# Altium schematic sheet I2S_ADC_OPTION.SchDoc
size A4
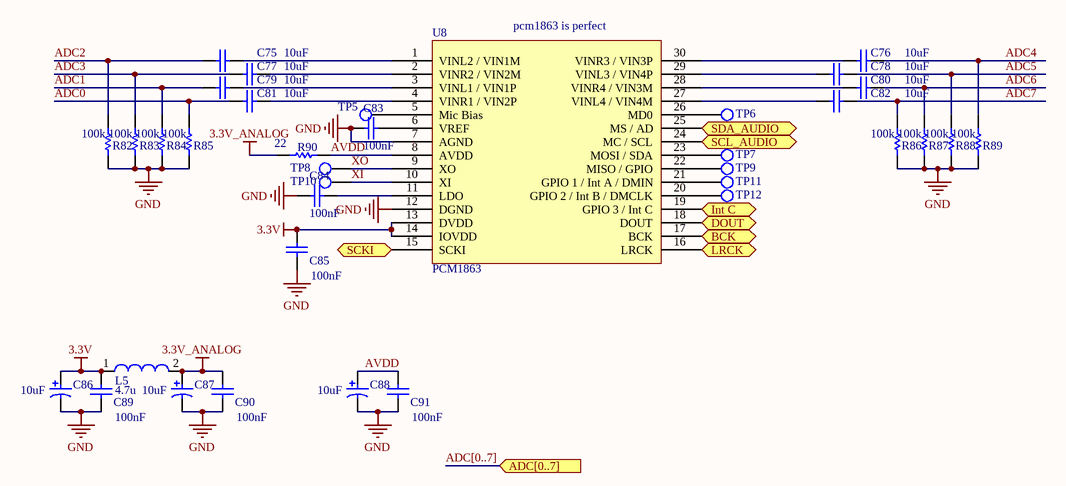
[diagram p0: I2S_ADC_OPTION.SchDoc]

## Parts
C75  value 10uF  [CAPC0402(1005)60_L]  (hidden comment: CAP0402)
C76  value 10uF  [CAPC0402(1005)60_L]  (hidden comment: CAP0402)
C77  value 10uF  [CAPC0402(1005)60_L]  (hidden comment: CAP0402)
C78  value 10uF  [CAPC0402(1005)60_L]  (hidden comment: CAP0402)
C79  value 10uF  [CAPC0402(1005)60_L]  (hidden comment: CAP0402)
C80  value 10uF  [CAPC0402(1005)60_L]  (hidden comment: CAP0402)
C81  value 10uF  [CAPC0402(1005)60_L]  (hidden comment: CAP0402)
C82  value 10uF  [CAPC0402(1005)60_L]  (hidden comment: CAP0402)
C83  value 100nF  [CAPC0402(1005)60_L]  (hidden comment: CAP0402)
C84  value 100nF  [CAPC0402(1005)60_L]  (hidden comment: CAP0402)
C85  value 100nF  [CAPC0402(1005)60_L]  (hidden comment: CAP0402)
C86  Capacitance: 10uF  [KEMT-A-3216-18-2_M]  (hidden comment: T491A106K016AT)
C87  Capacitance: 10uF  [KEMT-A-3216-18-2_M]  (hidden comment: T491A106K016AT)
C88  Capacitance: 10uF  [KEMT-A-3216-18-2_M]  (hidden comment: T491A106K016AT)
C89  value 100nF  [CAPC0402(1005)60_L]  (hidden comment: CAP0402)
C90  value 100nF  [CAPC0402(1005)60_L]  (hidden comment: CAP0402)
C91  value 100nF  [CAPC0402(1005)60_L]  (hidden comment: CAP0402)
L5  L: 4.7u  [TYS5020220M-10]  (hidden comment: TYS50204R7N-10)
R82  value 100k  [RESC0402(1005)_L]  (hidden comment: RES0402)
R83  value 100k  [RESC0402(1005)_L]  (hidden comment: RES0402)
R84  value 100k  [RESC0402(1005)_L]  (hidden comment: RES0402)
R85  value 100k  [RESC0402(1005)_L]  (hidden comment: RES0402)
R86  value 100k  [RESC0402(1005)_L]  (hidden comment: RES0402)
R87  value 100k  [RESC0402(1005)_L]  (hidden comment: RES0402)
R88  value 100k  [RESC0402(1005)_L]  (hidden comment: RES0402)
R89  value 100k  [RESC0402(1005)_L]  (hidden comment: RES0402)
R90  value 22  [RESC0402(1005)_L]  (hidden comment: RES0402)
TP5  Test Point  [Test_Point]  (value not drawn)
TP6  Test Point  [Test_Point]  (value not drawn)
TP7  Test Point  [Test_Point]  (value not drawn)
TP8  Test Point  [Test_Point]  (value not drawn)
TP9  Test Point  [Test_Point]  (value not drawn)
TP10  Test Point  [Test_Point]  (value not drawn)
TP11  Test Point  [Test_Point]  (value not drawn)
TP12  Test Point  [Test_Point]  (value not drawn)
U8  PCM1863  [TSSOP30]

## Ports
ADC[0..7] (in), BCK (bidir), DOUT (out), Int C (out), LRCK (bidir), SCKI (in), SCL_AUDIO (bidir), SDA_AUDIO (in)

## Nets
3.3V: C85.1 C86.1 C89.1 L5.1 U8.13(DVDD) U8.14(IOVDD)
3.3V_ANALOG: C87.1 C90.1 L5.2 R90.2
GND: C83.1 C84.1 C85.2 C86.2 C87.2 C88.2 C89.2 C90.2 C91.2 R82.1 R83.1 R84.1 R85.1 R86.1 R87.1 R88.1 R89.1 U8.7(AGND) U8.12(DGND)
ADC0: C81.1 R85.2
ADC1: C79.1 R84.2
ADC2: C75.1 R82.2
ADC3: C77.1 R83.2
ADC4: C78.2 R89.2
ADC5: C76.2 R88.2
ADC6: C80.2 R87.2
ADC7: C82.2 R86.2
AVDD: C88.1 C91.1 R90.1 U8.8(AVDD)
BCK: U8.17(BCK) ; port BCK
DOUT: U8.18(DOUT) ; port DOUT
Int C: U8.19(GPIO_3_/_Int_C) ; port Int C
LRCK: U8.16(LRCK) ; port LRCK
SCKI: U8.15(SCKI) ; port SCKI
SCL_AUDIO: U8.24(MC_/_SCL) ; port SCL_AUDIO
SDA_AUDIO: U8.25(MS_/_AD) ; port SDA_AUDIO
XI: TP10.1(TP) U8.10(XI)
XO: TP8.1(TP) U8.9(XO)
NetC75_2: C75.2 U8.1(VINL2_/_VIN1M)
NetC76_1: C76.1 U8.29(VINL3_/_VIN4P)
NetC77_2: C77.2 U8.2(VINR2_/_VIN2M)
NetC78_1: C78.1 U8.30(VINR3_/_VIN3P)
NetC79_2: C79.2 U8.3(VINL1_/_VIN1P)
NetC80_1: C80.1 U8.28(VINR4_/_VIN3M)
NetC81_2: C81.2 U8.4(VINR1_/_VIN2P)
NetC82_1: C82.1 U8.27(VINL4_/_VIN4M)
NetC83_2: C83.2 U8.6(VREF)
NetC84_2: C84.2 U8.11(LDO)
NetTP5_1: TP5.1(TP) U8.5(Mic_Bias)
NetTP6_1: TP6.1(TP) U8.26(MD0)
NetTP7_1: TP7.1(TP) U8.23(MOSI_/_SDA)
NetTP9_1: TP9.1(TP) U8.22(MISO_/_GPIO)
NetTP11_1: TP11.1(TP) U8.21(GPIO_1_/_Int_A_/_DMIN)
NetTP12_1: TP12.1(TP) U8.20(GPIO_2_/_Int_B_/_DMCLK)

## Buses and harness runs
bus ADC[0..7] = port ADC[0..7]

## Notes on the sheet
- (near U8) pcm1863 is perfect

## Library data of the parts
C75-C85 C89-C91 = CMP-1590-00004-1: 0402 (1005 Metric) Chip Capacitor; Case-EIA: 0402; Case-Metric: 1005; PackageReference: CAPC0402(1005)60
C86-C88 = CMP-2000-05173-1: Capacitor, Tantalum, 10 uF, +/- 10%, 16 V, -55 to 125 degC, 2-Pin SMD (1206), RoHS, Tape and Reel; Manufacturer: Kemet; Insulation: NotRequired; Voltage: 16VDC; Product Height (mm): 1.6mm; Polarity: Polar; Lead Spacing (nom): NotRequiredmm; Product Length (mm): 3.2mm; Case Style: Molded; DCL: 1.6uA; ESR: 7ohm; DF: 8%; Mounting Style: SurfaceMount; Manufacturer URL: http://www.kemet.com/; Datasheet Version: Apr-14; Package Description: 2-Pin Surface Mount Device, Body 3.2 x 1.6 mm; Operating Temp Range: -55Cto125C; Package Reference: 1206; Wire Form: NotRequired; Datasheet URL: http://www.farnell.com/datasheets/1824869.pdf; Tolerance (+ or -): 10%; Failure Rate: NotRequired; Length W/Weld: NotRequiredmm; Package / Case: 3216-18; Seated Plane Height: NotRequiredmm; Product Diameter (mm): NotRequiredmm; Construction: SMTChip; Seal: NotRequired; Case Code: A; Product Depth (mm): 1.6mm; Packaging: TapeandReel
L5 = TYS50204R7N-10: LAIRD TECHNOLOGIES  TYS50204R7N-10  Surface Mount Power Inductor, TYS Series, 4.7 µH, ± 30%, Shielded, 0.057 ohm, 2.2 A; Manufacturer: Wurth Elektronik; IR: 4.9 A; Isat: 5.5 A; Rdc typ.: 57 mOhm; Rdc max.: 22 mOhm; Frequence: 30 MHz; Unit Cost: .849; ComponentLink1Description: Manufacturer; ComponentLink1URL: http://ie.farnell.com/laird-technologies/tys50204r7n-10/inductor-4-7-h-smd/dp/2292526; Created by: Baojun Chen; Created Date: April 2016; ComponentLink2Description: Datasheet; ComponentLink2URL: http://katalog.we-online.com/pbs/datasheet/744066005.pdf; Maunfacturer Part Number: TYS50204R7N-10; Supplier 1: Farnell; Supplier Part Number 1: 2292526
R82-R90 = CMP-1591-00004-1: 0402 (1005 Metric) Chip Resistor; Case-EIA: 0402; Case-Metric: 1005; PackageReference: RESC0402(1005)
TP5-TP12 = Test_Point: HARWIN  S1751-46R  PCB Test Point, S1751 Series, Surface Mount, Copper Alloy, Tin Plated Contacts; Unit Cost: 0.129; ComponentLnkURL1: http://ie.farnell.com/harwin/s1751-46r/test-point-pcb-smt/dp/2293786?ost=2293786&selectedCategoryId=&categoryNameResp=All%2BCategories&searchView=table&iscrfnonsku=false; Manufacturer: HARWIN; Manufacturer Part Number: S1751-46R; Supplier 1: Farnell; Supplier Part Number 1: 2293786; Value: *
U8 = PCM1863: Manufacturer: Texas Instruments; Manufacturer Part Number: PCM1863DBTR; Resolution (Bits): 24 b; Data Interface: I²C, SPI; Voltage Supply Source: Single Supply; Voltage - Supply: 3.3V; Supplier 1: Digi-Key; RoHS: RoHS Compliant; Category: Integrated Circuits (ICs); Stock 1: 0; Pricing 1: 1=3.85, 10=3.452, 100=2.829, 500=2.40826, 1000=2.03106 (EUR); Packaging: Cut Tape (CT); Part Status: Active; Type: ADC, Audio; Sampling Rate (Per Second): -; Operating Temperature: -40°C ~ 125°C; Mounting Type: Surface Mount; Package / Case: 30-TFSOP (0.173", 4.40mm Width); Supplier Device Package: 30-TSSOP; Base Part Number: PCM1863; ComponentLink1URL: http://www.ti.com/lit/ds/symlink/pcm1861.pdf; ComponentLink1Description: http://www.ti.com/lit/ds/symlink/pcm1861.pdf; Supplier Part Number 1: 296-47817-1-ND